# Altium schematic sheet on-board_sensors.SchDoc
size A; SheetNumber: 4; SheetTotal: 7
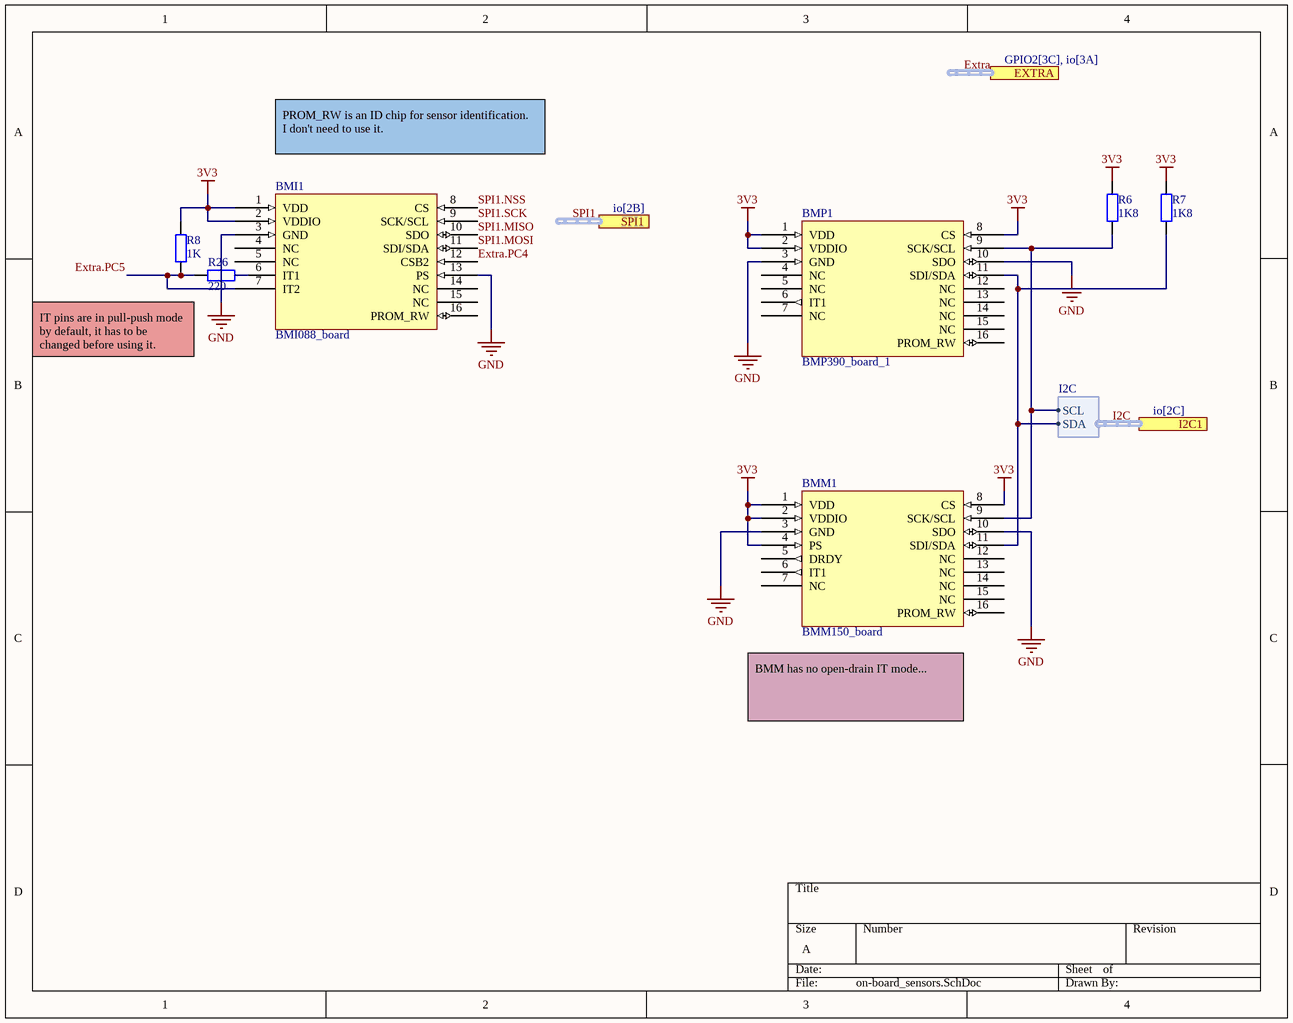
[diagram p0: on-board_sensors.SchDoc]

## Parts
BMI1  BMI088_board  [DIP7-9]
BMM1  BMM150_board  [DIP7-9]
BMP1  BMP390_board_1  [DIP7-9]
R6  1K8  [FP_0805_RES]
R7  1K8  [FP_0805_RES]
R8  1K  [FP_0805_RES]
R26  220  [FP_0805_RES]

## Ports
EXTRA (harness Extra_pins, see GPIO2[3C], io[3A]), I2C1 (harness I2C, see io[2C]), SPI1 (harness SPI, see io[2B])

## Harnesses
I2C: SCL, SDA

## Nets
3V3: BMI1.1(VDD) BMI1.2(VDDIO) BMM1.1(VDD) BMM1.2(VDDIO) BMM1.4(PS) BMM1.8(CS) BMP1.1(VDD) BMP1.2(VDDIO) BMP1.8(CS) R6.2 R7.2 R8.2
GND: BMI1.3(GND) BMI1.13(PS) BMM1.3(GND) BMM1.10(SDO) BMP1.3(GND) BMP1.10(SDO)
Extra.PC4: BMI1.12(CSB2)
Extra.PC5: BMI1.7(IT2) R8.1 R26.1
I2C.SCL: BMM1.9(SCK/SCL) BMP1.9(SCK/SCL) R6.1 ; port I2C1.SCL
I2C.SDA: BMM1.11(SDI/SDA) BMP1.11(SDI/SDA) R7.1 ; port I2C1.SDA
SPI1.MISO: BMI1.10(SDO)
SPI1.MOSI: BMI1.11(SDI/SDA)
SPI1.NSS: BMI1.8(CS)
SPI1.SCK: BMI1.9(SCK/SCL)
NetBMI1_6: BMI1.6(IT1) R26.2

Not connected (* = marked no-connect by the designer): BMI1 4(NC) 5(NC) 14(NC) 15(NC) 16(PROM_RW); BMM1 5(DRDY) 6(IT1) 7(NC) 12(NC) 13(NC) 14(NC) 15(NC) 16(PROM_RW); BMP1 4(NC) 5(NC) 6(IT1) 7(NC) 12(NC) 13(NC) 14(NC) 15(NC) 16(PROM_RW)

## Buses and harness runs
harness Extra = port EXTRA
harness I2C = port I2C1
harness SPI1 = port SPI1

## Notes on the sheet
- PROM_RW is an ID chip for sensor identification.
  I don't need to use it.
- IT pins are in pull-push mode by default, it has to be changed before using it.
- (near BMM1) BMM has no open-drain IT mode...

## Library data of the parts
R6-R8 R26 = RES: Resistor
  R6 R7: Value: 1K8
  R8: Value: 1K
  R26: Value: 220